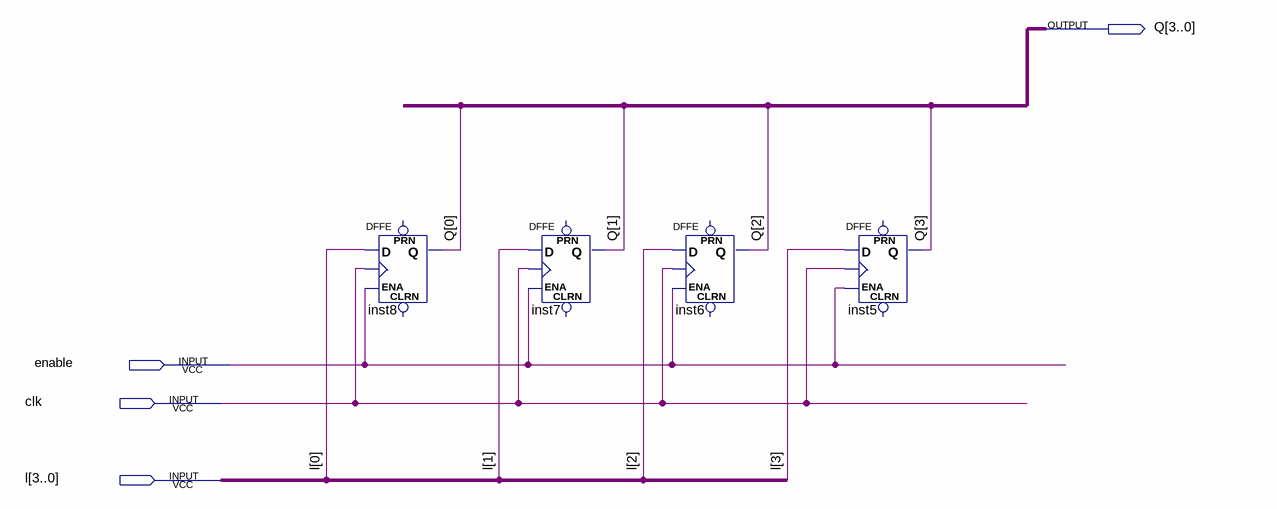
[diagram p0: schematic sheet]
// Quartus schematic Block7.bdf as structural Verilog: 4 symbols, 4 pins
module Block7 (
  input  enable,
  input  clk,
  input  [3:0] l,
  output [3:0] Q
);

  DFFE inst8 (.D(l[0]), .CLK(clk), .ENA(enable), .Q(Q[0]));  // open: PRN, CLRN
  DFFE inst7 (.D(l[1]), .CLK(clk), .ENA(enable), .Q(Q[1]));  // open: PRN, CLRN
  DFFE inst6 (.D(l[2]), .CLK(clk), .ENA(enable), .Q(Q[2]));  // open: PRN, CLRN
  DFFE inst5 (.D(l[3]), .CLK(clk), .ENA(enable), .Q(Q[3]));  // open: PRN, CLRN
endmodule
